# Altium project ice40.PrjPcb
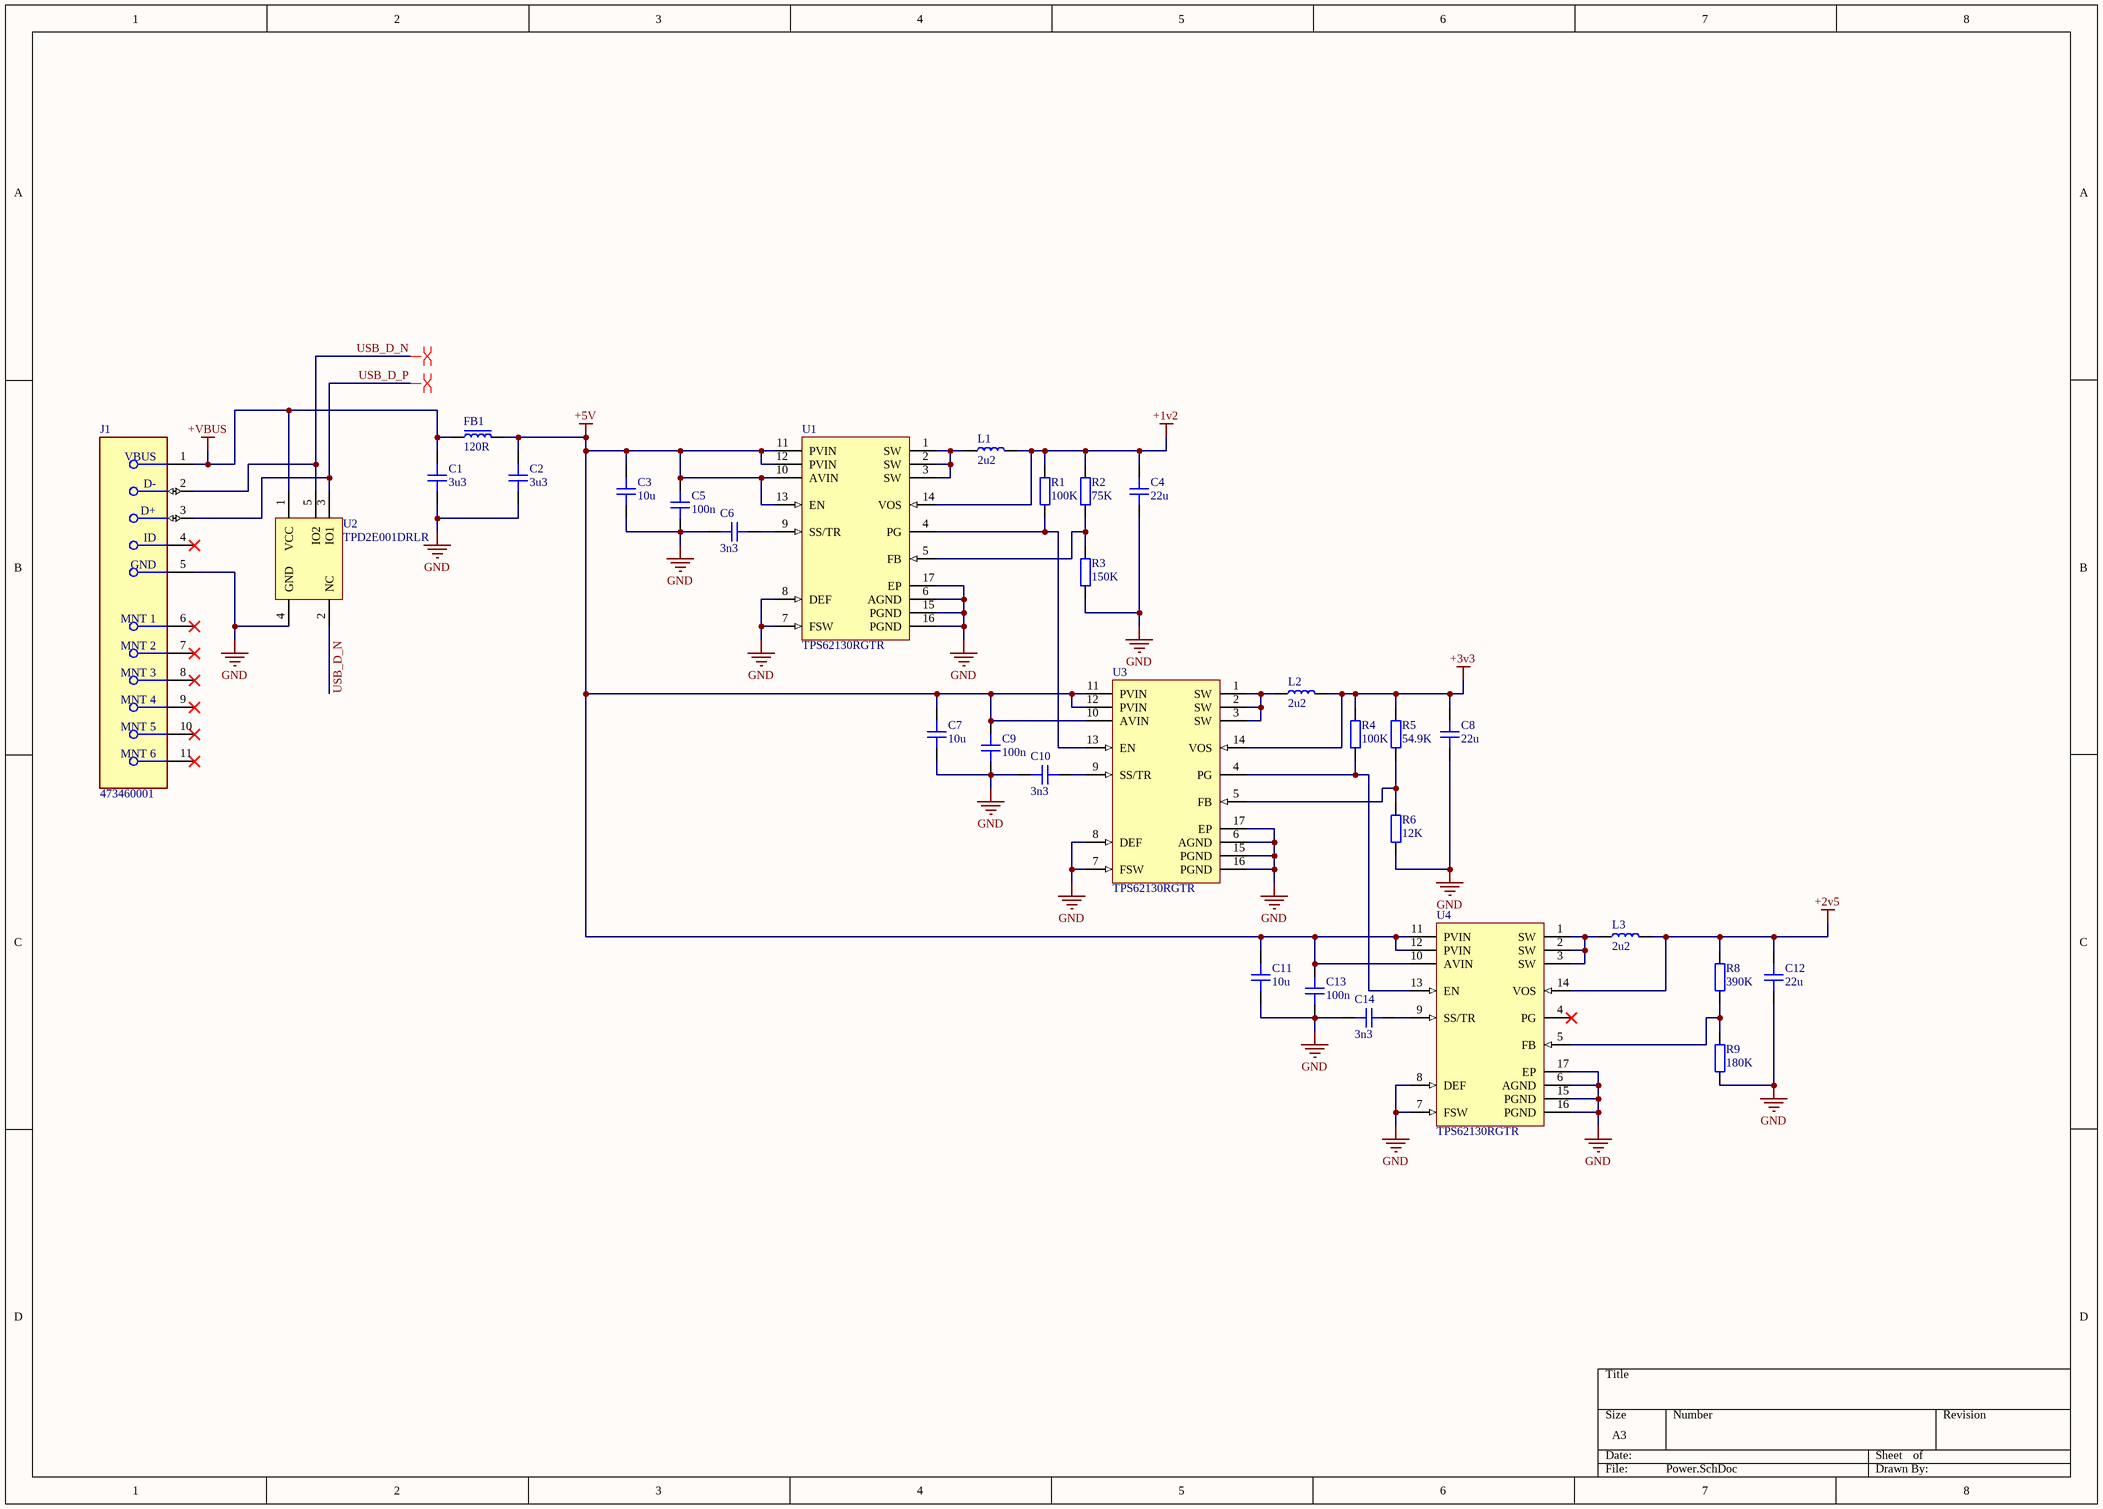
[diagram p0: Power.SchDoc]
3 sheets, 94 parts. Net scope: global (net labels, ports and power ports of the same name join across sheets).
Board file: PCB.PcbDoc
Sheets:
  Power.SchDoc
  IO.SchDoc
  ice40.SchDoc

## Sheet Power.SchDoc
size A3; SheetNumber: 1; SheetTotal: 3

### Parts
C1  3u3  [CAP_0603]
C2  3u3  [CAP_0603]
C3  10u  [CAP_0805]
C4  22u  [CAP_0805]
C5  100n  [CAP_0402]
C6  3n3  [CAP_0402]
C7  10u  [CAP_0805]
C8  22u  [CAP_0805]
C9  100n  [CAP_0402]
C10  3n3  [CAP_0402]
C11  10u  [CAP_0805]
C12  22u  [CAP_0805]
C13  100n  [CAP_0402]
C14  3n3  [CAP_0402]
FB1  120R  [FB_0603]
J1  473460001  [FP-473460001-MFG]
L1  2u2  [IND_1008]
L2  2u2  [IND_1008]
L3  2u2  [IND_1008]
R1  100K  [RES_0402]
R2  75K  [RES_0402]
R3  150K  [RES_0402]
R4  100K  [RES_0402]
R5  54.9K  [RES_0402]
R6  12K  [RES_0402]
R8  390K  [RES_0402]
R9  180K  [RES_0402]
U1  TPS62130RGTR  [RGT0016C_V]
U2  TPD2E001DRLR  [DRL0005A_L]
U3  TPS62130RGTR  [RGT0016C_V]
U4  TPS62130RGTR  [RGT0016C_V]

### Nets
+1v2: C4.2 L1.2 R1.2 R2.2 U1.14(VOS)
+2v5: C12.2 L3.2 R8.2 U4.14(VOS)
+3v3: C8.2 L2.2 R4.2 R5.2 U3.14(VOS)
+5V: C2.2 C3.2 C5.2 C7.2 C9.2 C11.2 C13.2 FB1.2 U1.10(AVIN) U1.11(PVIN) U1.12(PVIN) U1.13(EN) U3.10(AVIN) U3.11(PVIN) U3.12(PVIN) U4.10(AVIN) U4.11(PVIN) U4.12(PVIN)
+VBUS: C1.2 FB1.1 J1.1(VBUS) U2.1(VCC)
GND: C1.1 C2.1 C3.1 C4.1 C5.1 C6.2 C7.1 C8.1 C9.1 C10.2 C11.1 C12.1 C13.1 C14.2 J1.5(GND) R3.1 R6.1 R9.1 U1.6(AGND) U1.7(FSW) U1.8(DEF) U1.15(PGND) U1.16(PGND) U1.17(EP) U2.4(GND) U3.6(AGND) U3.7(FSW) U3.8(DEF) U3.15(PGND) U3.16(PGND) U3.17(EP) U4.6(AGND) U4.7(FSW) U4.8(DEF) U4.15(PGND) U4.16(PGND) U4.17(EP)
USB_D_N: J1.2(D-) U2.2(NC) U2.5(IO2)
USB_D_P: J1.3(D+) U2.3(IO1)
NetC6_1: C6.1 U1.9(SS/TR)
NetC10_1: C10.1 U3.9(SS/TR)
NetC14_1: C14.1 U4.9(SS/TR)
NetL1_1: L1.1 U1.1(SW) U1.2(SW) U1.3(SW)
NetL2_1: L2.1 U3.1(SW) U3.2(SW) U3.3(SW)
NetL3_1: L3.1 U4.1(SW) U4.2(SW) U4.3(SW)
NetR1_1: R1.1 U1.4(PG) U3.13(EN)
NetR2_1: R2.1 R3.2 U1.5(FB)
NetR4_1: R4.1 U3.4(PG) U4.13(EN)
NetR5_1: R5.1 R6.2 U3.5(FB)
NetR8_1: R8.1 R9.2 U4.5(FB)

Not connected (* = marked no-connect by the designer): J1 4(ID)* 6(MNT_1)* 7(MNT_2)* 8(MNT_3)* 9(MNT_4)* 10(MNT_5)* 11(MNT_6)*; U4 4(PG)*

### Layout directives
differential pair: USB_D_N, USB_D_P

### Library data of the parts
C1 C2 = CAP_0603: Capacitor SMD 0603; Manufacturer Part Number: TCC0603X5R335M250CT; Manufacturer: *; Distributor Link: *; LCSC: C5360803; Rating: *; Dielectric: *
C3 C7 C11 = CAP_0805: Capacitor SMD 0805; Manufacturer Part Number: CL21B106KOQNNNE; Manufacturer: *; Distributor Link: *; LCSC: C95841; Rating: *; Dielectric: *
C4 C8 C12 = CAP_0805: Capacitor SMD 0805; Manufacturer Part Number: GRM21BZ71A226ME15L; Manufacturer: *; Distributor Link: *; LCSC: C907991; Rating: *; Dielectric: *
C5 C9 C13 = CAP_0402: Capacitor SMD 0402; Manufacturer Part Number: CL05B104KO5NNNC; Manufacturer: *; Distributor Link: *; LCSC: C1525; Rating: *; Dielectric: *
C6 C10 C14 = CAP_0402: Capacitor SMD 0402; Manufacturer Part Number: CL05B332KB5NNNC; Manufacturer: *; Distributor Link: *; LCSC: C26404; Rating: *; Dielectric: *
FB1 = FB_0603: Ferrite Bead SMD 0603; Manufacturer Part Number: BLM18PG121SN1D; Manufacturer: *; Distributor Link: *; LCSC: C14709
J1 = CMP-2000-05246-2: CONN RCPT USB2.0 MICRO B SMD R/A; Manufacturer: Molex; Conn Orientation: Right Angle; Is Female: yes; Shielding: true; Pitch: 0.65mm; Number Of Contacts: 5; Voltage Rating: 30V; Current Rating: 1.8A; Device Class L2: USB Connectors; Digikey Description: CONN RCPT USB2.0 MICRO B SMD R/A; Height: 2.945mm; RoHS: TRUE; ComponentLink2Description: Datasheet; Octopart: https://octopart.com/47346-0001-molex-7164928; Automotive: No; Package: 0; Category: Conn; Device Class L1: Connectors; Usb Standard: USB 2.0; Temperature: -30°C to +85°C; Temperature Range Low: -30°C; Footprint Url: https://www.molex.com/pdm_docs/sd/473460001_sd.pdf; ComponentLink2URL: https://www.molex.com/webdocs/datasheets/pdf/en-us/0473460001_IO_CONNECTORS.pdf; Lead Free: Yes; Manufacturer Part Number: 473460001; Contact Material: Gold,Nickel; Temperature Range High: +85°C; Device Class L3: unset; LCSC: C132560
L1-L3 = IND_1008: Inductor SMD 1008; Manufacturer Part Number: LQM2HPN2R2MG0L; LCSC: C86092
R1 R4 = RES_0402: Resistor SMD 0402; Manufacturer Part Number: 0402WGF1003TCE; Manufacturer: *; Distributor Link: *; LCSC: C25741
R2 = RES_0402: Resistor SMD 0402; Manufacturer Part Number: 0402WGF7502TCE; Manufacturer: *; Distributor Link: *; LCSC: C25798
R3 = RES_0402: Resistor SMD 0402; Manufacturer Part Number: FRC0402F1503TS; Manufacturer: *; Distributor Link: *; LCSC: C2909320
R5 = RES_0402: Resistor SMD 0402; Manufacturer Part Number: 0402WGF5492TCE; Manufacturer: *; Distributor Link: *; LCSC: C11626
R6 = RES_0402: Resistor SMD 0402; Manufacturer Part Number: 0402WGF1202TCE; Manufacturer: *; Distributor Link: *; LCSC: C25752
R8 = RES_0402: Resistor SMD 0402; Manufacturer Part Number: 0402WGF3903TCE; Manufacturer: *; Distributor Link: *; LCSC: C25782
R9 = RES_0402: Resistor SMD 0402; Manufacturer Part Number: 0402WGF1803TCE; Manufacturer: *; Distributor Link: *; LCSC: C25760
U1 U3 U4 = CMP-0323-00115-3: Buck Step Down Regulator with 3 to 17 V Input and 0.9 to 6 V Output, -40 to 85 degC, 16-Pin QFN (RGT), Green (RoHS & no Sb/Br); Manufacturer: Texas Instruments; Rating: Catalog; Vout(Max)(V): 6; Vin(Min)(V): 3; Switch Current Limit(Typ)(A): 4.2; Iq(Typ)(mA): 0.017; Regulated Outputs(#): 1; Synchronous Rectification: TRUE; SubFamily: Step-Down Regulator; Vin(Max)(V): 17; Duty Cycle(Max)(%): 100; Vout(Min)(V): 0.9; ComponentLink2URL: http://www.ti.com/litv/pdf/mpqf119g; Eco-Plan: Green (RoHS & no Sb/Br); Manufacturer Part Number: TPS62130RGTR; ComponentLink1Description: Datasheet; DatasheetVersion: SLVSAG7; Mounting Technology: Surface Mount; Iout(Max)(A): 3; ComponentLink2Description: Package Specification; Code_JEDEC: MO-220; Topology: Buck; ComponentLink1URL: http://www.ti.com/general/docs/lit/getliterature.tsp?genericPartNumber=TPS62130&fileType=pdf; ComponentLink3URL: Samples URL:http://www.ti.com/product/tps62130#samples; ComponentLink3Description: URL Link1; PackageReference: RGT0016C; PackageVersion: revH, Oct-2011; PackageDescription: 16-Pin Plastic Quad Flat No-Lead, 3 x 3 mm Body, 0.5 mm Pitch, 1.7 x 1.7 mm Exposed Pad; LCSC: C43590
  U3: Parameter 1: *
U2 = CMP-0326-00048-3: Low-Capacitance + / - 15 kV ESD-Protection Array for High-Speed Data Interfaces, 2 Channels, -40 to +85 degC, 5-pin SOT (DRL), Green (RoHS & no Sb/Br); Manufacturer: Texas Instruments; IO Leakage Current(nA): 1; IEC 61000-4-2 Air-Gap(+/- kV): 15; IEC 61000-4-2 Contact(+/- kV): 8; SubFamily: ESD Solution; IO Capacitance(Typ)(pF): 1.5; Breakdown Voltage(Min)(V): 11; USB High Speed: TRUE; ComponentLink3Description: URL Link1; PackageReference: DRL0005A; Manufacturer Part Number: TPD2E001DRLR; PackageDescription: 5-Pin Plastic Small Outline, Flat Lead 0.5 mm Pitch; PackageVersion: revD, Aug-2007; DatasheetVersion: SLLS684F; ComponentLink1Description: Manufacturer URL; ComponentLink2Description: Datasheet; ComponentLink1URL: http://www.ti.com/; ComponentLink2URL: http://www.ti.com/general/docs/lit/getliterature.tsp?genericPartNumber=TPD2E001&fileType=pdf; ComponentLink3URL: SamplesURL:http://www.ti.com/product/tpd2e001#samples; Eco-Plan: Green (RoHS & no Sb/Br); Mounting Technology: Surface Mount; LCSC: C150526

## Sheet IO.SchDoc
size A3; SheetNumber: 2; SheetTotal: 3
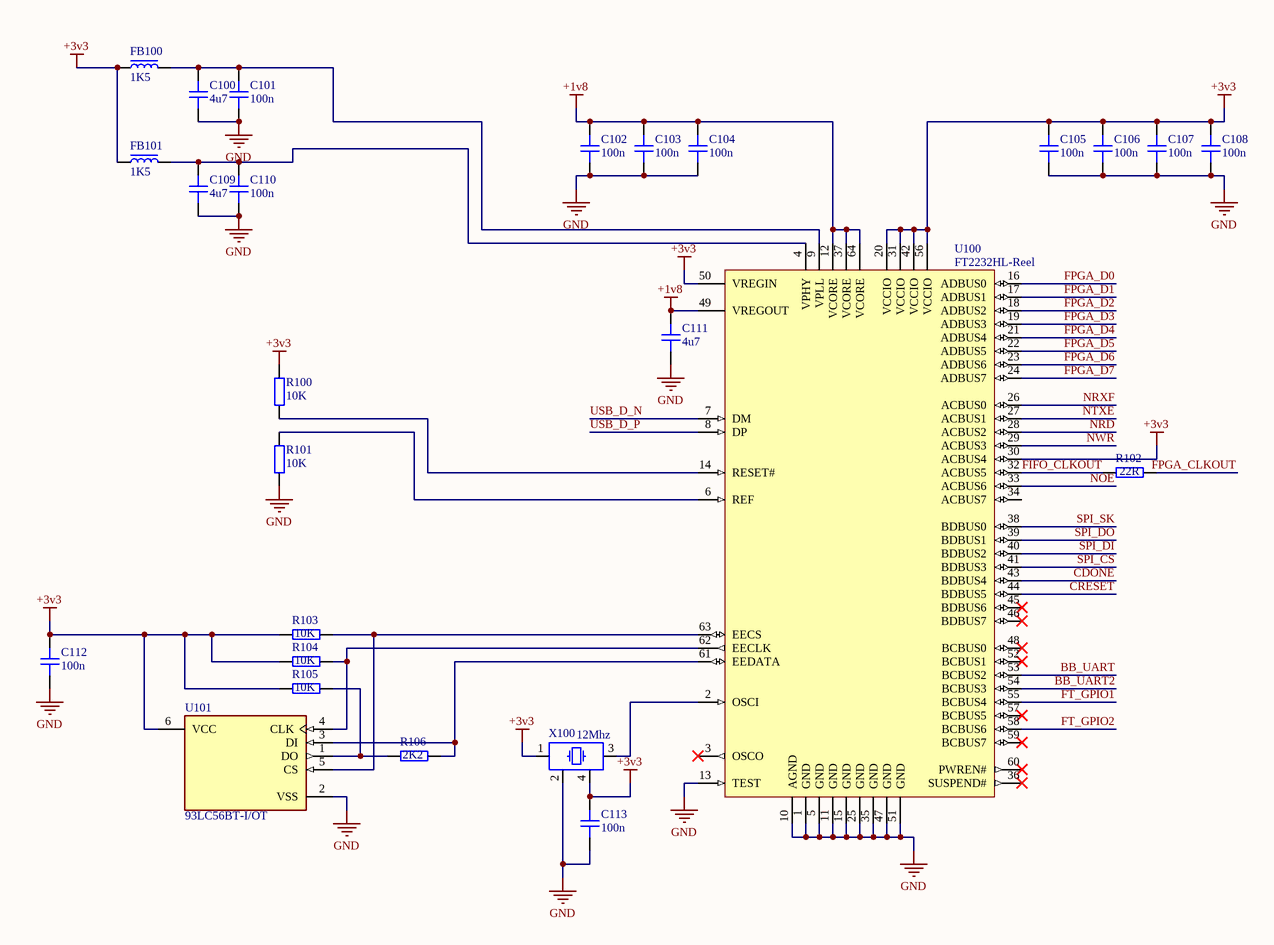
[diagram p1: IO.SchDoc]

### Parts
C100  4u7  [CAP_0402]
C101  100n  [CAP_0402]
C102  100n  [CAP_0402]
C103  100n  [CAP_0402]
C104  100n  [CAP_0402]
C105  100n  [CAP_0402]
C106  100n  [CAP_0402]
C107  100n  [CAP_0402]
C108  100n  [CAP_0402]
C109  4u7  [CAP_0402]
C110  100n  [CAP_0402]
C111  4u7  [CAP_0402]
C112  100n  [CAP_0402]
C113  100n  [CAP_0402]
FB100  1K5  [FB_0603]
FB101  1K5  [FB_0603]
R100  10K  [RES_0402]
R101  10K  [RES_0402]
R102  22R  [RES_0402]
R103  10K  [RES_0402]
R104  10K  [RES_0402]
R105  10K  [RES_0402]
R106  2K2  [RES_0402]
U100  FT2232HL-Reel  [LQFP-64_M]
U101  93LC56BT-I/OT  [FP-C04-028-MFG]
X100  12Mhz  [XTAL_2520]

### Nets
+1v8: C102.2 C103.2 C104.2 C111.2 U100.12(VCORE) U100.37(VCORE) U100.49(VREGOUT) U100.64(VCORE)
+3v3: C105.2 C106.2 C107.2 C108.2 C112.2 C113.2 FB100.1 FB101.1 R100.2 R103.1 R104.1 R105.1 U100.20(VCCIO) U100.30(ACBUS4) U100.31(VCCIO) U100.42(VCCIO) U100.50(VREGIN) U100.56(VCCIO) U101.6(VCC) X100.1 X100.4
GND: C100.1 C101.1 C102.1 C103.1 C104.1 C105.1 C106.1 C107.1 C108.1 C109.1 C110.1 C111.1 C112.1 C113.1 R101.2 U100.1(GND) U100.5(GND) U100.10(AGND) U100.11(GND) U100.13(TEST) U100.15(GND) U100.25(GND) U100.35(GND) U100.47(GND) U100.51(GND) U101.2(VSS) X100.2
BB_UART: U100.53(BCBUS2)
BB_UART2: U100.54(BCBUS3)
CDONE: U100.43(BDBUS4)
CRESET: U100.44(BDBUS5)
FIFO_CLKOUT: R102.1 U100.32(ACBUS5)
FPGA_CLKOUT: R102.2
FPGA_D0: U100.16(ADBUS0)
FPGA_D1: U100.17(ADBUS1)
FPGA_D2: U100.18(ADBUS2)
FPGA_D3: U100.19(ADBUS3)
FPGA_D4: U100.21(ADBUS4)
FPGA_D5: U100.22(ADBUS5)
FPGA_D6: U100.23(ADBUS6)
FPGA_D7: U100.24(ADBUS7)
FT_GPIO1: U100.55(BCBUS4)
FT_GPIO2: U100.58(BCBUS6)
NOE: U100.33(ACBUS6)
NRD: U100.28(ACBUS2)
NRXF: U100.26(ACBUS0)
NTXE: U100.27(ACBUS1)
NWR: U100.29(ACBUS3)
SPI_CS: U100.41(BDBUS3)
SPI_DI: U100.40(BDBUS2)
SPI_DO: U100.39(BDBUS1)
SPI_SK: U100.38(BDBUS0)
USB_D_N: U100.7(DM)
USB_D_P: U100.8(DP)
NetC100_2: C100.2 C101.2 FB100.2 U100.9(VPLL)
NetC109_2: C109.2 C110.2 FB101.2 U100.4(VPHY)
NetR100_1: R100.1 U100.14(RESET#)
NetR101_1: R101.1 U100.6(REF)
NetR103_2: R103.2 U100.63(EECS) U101.5(CS)
NetR104_2: R104.2 U100.62(EECLK) U101.4(CLK)
NetR105_2: R105.2 R106.1 U101.1(DO)
NetR106_2: R106.2 U100.61(EEDATA) U101.3(DI)
NetU100_2: U100.2(OSCI) X100.3

Not connected (* = marked no-connect by the designer): U100 3(OSCO)* 34(ACBUS7) 36(SUSPEND#)* 45(BDBUS6)* 46(BDBUS7)* 48(BCBUS0)* 52(BCBUS1)* 57(BCBUS5)* 59(BCBUS7)* 60(PWREN#)*

### Library data of the parts
C100 C109 C111 = CAP_0402: Capacitor SMD 0402; Manufacturer Part Number: GRM155R61E475ME15D; Manufacturer: *; Distributor Link: *; LCSC: C2858031; Rating: *; Dielectric: *
C101-C108 C110 C112 C113 = CAP_0402: as C5 on sheet Power; Manufacturer: *; Distributor Link: *; LCSC: C1525; Rating: *; Dielectric: *
FB100 FB101 = FB_0603: Ferrite Bead SMD 0603; Manufacturer Part Number: BLM18HE152SN1D; Manufacturer: *; Distributor Link: *; LCSC: C82155
R100 R101 R103-R105 = RES_0402: Resistor SMD 0402; Manufacturer Part Number: 0402WGF1002TCE; Manufacturer: *; Distributor Link: *; LCSC: C25744
R102 = RES_0402: Resistor SMD 0402; Manufacturer Part Number: 0402WGF220JTCE; Manufacturer: *; Distributor Link: *; LCSC: C25092
R106 = RES_0402: Resistor SMD 0402; Manufacturer Part Number: 0402WGF2201TCE; Manufacturer: *; Distributor Link: *; LCSC: C25879
U100 = CMP-0078-00023-3: Dual High Speed USB To Multipurpose UART/FIFO IC, 64-pin LQFP, Tape and Reel; Manufacturer: FTDI; DatasheetVersion: ver 2.21, Jun-2012; ComponentLink1URL: http://www.ftdichip.com/; Manufacturer Part Number: FT2232HL-Reel; ComponentLink2Description: Datasheet; RevisionNote: DatasheetVersion updated to 2.21 Jun-2012; PackageVersion: Jun-12; ComponentLink1Description: Manufacturer URL; ComponentLink2URL: http://www.ftdichip.com/Support/Documents/DataSheets/ICs/DS_FT2232H.pdf; PackageReference: LQFP-64; PackageDescription: 64-Pin Thin Quad Flat Pack, 10 x 10 x 1.4 mm Body, 0.5 mm Pitch; LCSC: C27882
U101 = CMP-0162-00356-2: IC EEPROM 2K SPI 2MHZ SOT23-6; Access Time: 250ns; Density: 2Kb; Max Supply Voltage: 5.5V; Interface: Serial; Min Supply Voltage: 2.5V; Nominal Supply Current: 2mA; Number of Pins: 6; Radiation Hardening: No; Length: 3.1mm; Height: 1.3mm; Min Operating Temperature: -40°C; Max Operating Temperature: 85°C; Lead Free: Lead Free; Memory Type: EEPROM; Contact Plating: Tin; REACH SVHC: No SVHC; Package Quantity: 3000; Frequency: 2MHz; Width: 1.8mm; Max Frequency: 2MHz; Case/Package: SOT-23; Mount: Surface Mount; Packaging: Tape and Reel; Memory Size: 2Kb; LCSC: C190271; Manufacturer Part Number: 93LC56BT-I/OT
X100 = XTAL_2520: Crystal SMD 2520; Manufacturer Part Number: SX2M12.000B10F20TNN; Manufacturer: *; Distributor Link: *; LCSC: C7431262

## Sheet ice40.SchDoc
size A3; SheetNumber: 3; SheetTotal: 3
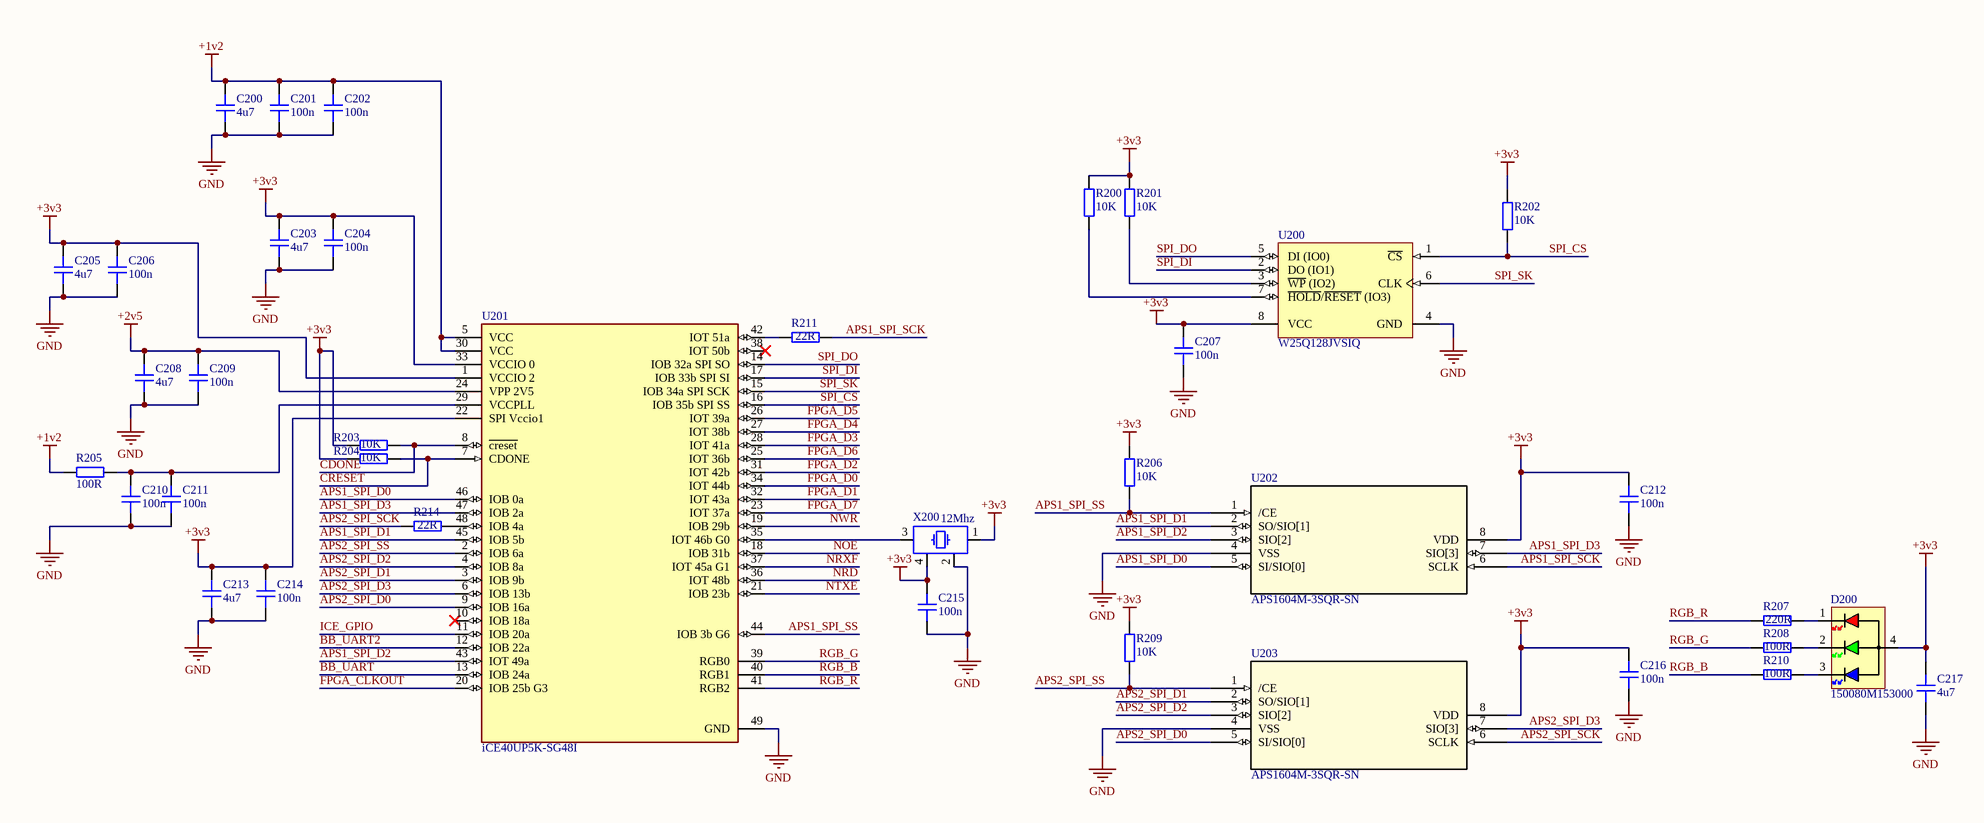
[diagram p2: ice40.SchDoc]

### Parts
C200  4u7  [CAP_0402]
C201  100n  [CAP_0402]
C202  100n  [CAP_0402]
C203  4u7  [CAP_0402]
C204  100n  [CAP_0402]
C205  4u7  [CAP_0402]
C206  100n  [CAP_0402]
C207  100n  [CAP_0402]
C208  4u7  [CAP_0402]
C209  100n  [CAP_0402]
C210  100n  [CAP_0402]
C211  100n  [CAP_0402]
C212  100n  [CAP_0402]
C213  4u7  [CAP_0402]
C214  100n  [CAP_0402]
C215  100n  [CAP_0402]
C216  100n  [CAP_0402]
C217  4u7  [CAP_0402]
D200  150080M153000  [150080M153000]
R200  10K  [RES_0402]
R201  10K  [RES_0402]
R202  10K  [RES_0402]
R203  10K  [RES_0402]
R204  10K  [RES_0402]
R205  100R  [RES_0402]
R206  10K  [RES_0402]
R207  220R  [RES_0402]
R208  100R  [RES_0402]
R209  10K  [RES_0402]
R210  100R  [RES_0402]
R211  22R  [RES_0402]
R214  22R  [RES_0402]
U200  W25Q128JVSIQ  [WINB-SOIC-8_M]
U201  iCE40UP5K-SG48I  [FP-QFN-48-IPC_C]
U202  APS1604M-3SQR-SN  [SOP8L_APS1604M-3SQR-SN_APY]
U203  APS1604M-3SQR-SN  [SOP8L_APS1604M-3SQR-SN_APY]
X200  12Mhz  [XTAL_2520]

### Nets
+1v2: C200.2 C201.2 C202.2 R205.1 U201.5(VCC) U201.30(VCC)
+2v5: C208.2 C209.2 U201.24(VPP_2V5)
+3v3: C203.2 C204.2 C205.2 C206.2 C207.2 C212.2 C213.2 C214.2 C215.1 C216.2 C217.2 D200.4(AC) R200.2 R201.2 R202.2 R203.1 R204.1 R206.2 R209.2 U200.8(VCC) U201.1(VCCIO_2) U201.22(SPI_Vccio1) U201.33(VCCIO_0) U202.8(VDD) U203.8(VDD) X200.1 X200.4
GND: C200.1 C201.1 C202.1 C203.1 C204.1 C205.1 C206.1 C207.1 C208.1 C209.1 C210.1 C211.1 C212.1 C213.1 C214.1 C215.2 C216.1 C217.1 U200.4(GND) U201.49(GND) U202.4(VSS) U203.4(VSS) X200.2
APS1_SPI_D0: U201.46(IOB_0a) U202.5(SI/SIO[0])
APS1_SPI_D1: U201.45(IOB_5b) U202.2(SO/SIO[1])
APS1_SPI_D2: U201.43(IOT_49a) U202.3(SIO[2])
APS1_SPI_D3: U201.47(IOB_2a) U202.7(SIO[3])
APS1_SPI_SCK: R211.2 U202.6(SCLK)
APS1_SPI_SS: R206.1 U201.44(IOB_3b_G6) U202.1(/CE)
APS2_SPI_D0: U201.9(IOB_16a) U203.5(SI/SIO[0])
APS2_SPI_D1: U201.3(IOB_9b) U203.2(SO/SIO[1])
APS2_SPI_D2: U201.4(IOB_8a) U203.3(SIO[2])
APS2_SPI_D3: U201.6(IOB_13b) U203.7(SIO[3])
APS2_SPI_SCK: R214.1 U203.6(SCLK)
APS2_SPI_SS: R209.1 U201.2(IOB_6a) U203.1(/CE)
BB_UART: U201.13(IOB_24a)
BB_UART2: U201.12(IOB_22a)
CDONE: R203.2 U201.8(~{creset})
CRESET: R204.2 U201.7(CDONE)
FPGA_CLKOUT: U201.20(IOB_25b_G3)
FPGA_D0: U201.34(IOT_44b)
FPGA_D1: U201.32(IOT_43a)
FPGA_D2: U201.31(IOT_42b)
FPGA_D3: U201.28(IOT_41a)
FPGA_D4: U201.27(IOT_38b)
FPGA_D5: U201.26(IOT_39a)
FPGA_D6: U201.25(IOT_36b)
FPGA_D7: U201.23(IOT_37a)
ICE_GPIO: U201.11(IOB_20a)
NOE: U201.18(IOB_31b)
NRD: U201.36(IOT_48b)
NRXF: U201.37(IOT_45a_G1)
NTXE: U201.21(IOB_23b)
NWR: U201.19(IOB_29b)
RGB_B: R210.1 U201.40(RGB1)
RGB_G: R208.1 U201.39(RGB0)
RGB_R: R207.1 U201.41(RGB2)
SPI_CS: R202.1 U200.1(~{CS}) U201.16(IOB_35b_SPI_SS)
SPI_DI: U200.2(DO_(IO1)) U201.17(IOB_33b_SPI_SI)
SPI_DO: U200.5(DI_(IO0)) U201.14(IOB_32a_SPI_SO)
SPI_SK: U200.6(CLK) U201.15(IOB_34a_SPI_SCK)
NetC210_2: C210.2 C211.2 R205.2 U201.29(VCCPLL)
NetD200_1: D200.1(CR) R207.2
NetD200_2: D200.2(CG) R208.2
NetD200_3: D200.3(CB) R210.2
NetR200_1: R200.1 U200.7(~{HOLD}/~{RESET}_(IO3))
NetR201_1: R201.1 U200.3(~{WP}_(IO2))
NetR211_1: R211.1 U201.42(IOT_51a)
NetR214_2: R214.2 U201.48(IOB_4a)
NetU201_35: U201.35(IOT_46b_G0) X200.3

Not connected (* = marked no-connect by the designer): U201 10(IOB_18a)* 38(IOT_50b)*

### Library data of the parts
C200 C203 C205 C208 C213 C217 = CAP_0402: as C100 on sheet IO; Manufacturer: *; Distributor Link: *; LCSC: C2858031; Rating: *; Dielectric: *
C201 C202 C204 C206 C207 C209-C212 C214-C216 = CAP_0402: as C5 on sheet Power; Manufacturer: *; Distributor Link: *; LCSC: C1525; Rating: *; Dielectric: *
D200 = 150080M153000: RGB LED Common Anode SMD Diffused 0805 Top View; Manufacturer: Wurth; Manufacturer Part Number: 150080M153000; Distributor Link: https://www.mouser.de/ProductDetail/Wurth-Elektronik/150080M153000?qs=5aG0NVq1C4wI5cZ2wabu5A%3D%3D; LCSC: C6785001
R200-R204 R206 R209 = RES_0402: as R100 on sheet IO; Manufacturer: *; Distributor Link: *; LCSC: C25744
R205 R208 R210 = RES_0402: Resistor SMD 0402; Manufacturer Part Number: 0402WGF1000TCE; Manufacturer: *; Distributor Link: *; LCSC: C25076
R207 = RES_0402: Resistor SMD 0402; Manufacturer Part Number: 0402WGF2200TCE; Manufacturer: *; Distributor Link: *; LCSC: C25091
R211 R214 = RES_0402: as R102 on sheet IO; Manufacturer: *; Distributor Link: *; LCSC: C25092
U200 = CMP-2000-05005-1: 3V 128M-Bit Serial Flash Memory with Dual/Quad SPI & QPI, 2.7 to 3.6 V, -40 to 85 degC, 8-Pin SOIC, RoHS, Tape and Reel; Manufacturer: Winbond; Number of Words: 16777216; Address Bus: 24b; Word Size: 8b; Boot Type: NotRequired; Supply Current: 20mA; Operating Supply Voltage (Max): 3.6V; Sync/Async: Synchronous; Rad Hardened: No; Interface Type: Serial(SPI); Access Time (Max): 7ns; Operating Supply Voltage (Min): 2.7V; Operating Supply Voltage (Typ): 3/3.3V; Programmable: Yes; Density: 134217728Bit; Cell Type: NOR; Package Description: 8-Pin Small Outline Integrated Circuit, Body 5.28 x 5.28 mm, Pitch 1.27 mm; Datasheet URL: http://download.siliconexpert.com/pdfs/2015/11/30/6/42/17/890/win_/manual/3w25q128fv20rev.l2008242015.pdf; Package Reference: SS-8; Package Type: SOICW; Datasheet Version: Rev. L, 08/2015; Manufacturer URL: http://www.winbond.com/hq/index.html?__locale=en; Pin Count: 8; Operating Temperature Classification: Industrial; Operating Temperature (Min): -40C; Program/Erase Volt (Typ): 2.7to3.6V; Operating Temperature (Max): 85C; Mounting: SurfaceMount; Operating Temp Range: -40Cto85C; LCSC: C113767; Manufacturer Part Number: W25Q128JVSIQ
U201 = CMP-17932-000001-1: ICE40-ULTRAPLUS, 5280 LUTS, 1.2V; Manufacturer: Lattice; Propagation Delay: 9ns; Frequency: 48MHz; Max Junction Temp: +100°C; Ram Size: 1024Kbits; Number Of Logic Elements Cells: 5280; Number Of I/Os: 39; Max Supply Voltage: 3.46V; Standoff Height: 0mm; Nominal Supply Current: 2.5-12mA; Min Supply Voltage: 1.14V; Number Of Logic Blocks: 660; Device Class L3: FPGAs - Field Programmable Gate Arrays; Temperature Range High: +100°C; Device Class L1: Integrated Circuits (ICs); Device Class L2: Embedded Processors and Controllers; Ipc Land Pattern Name: QFN50P700X700X90-48; Automotive: No; RoHS: TRUE; Lead Free: Yes; Height: 1mm; ComponentLink2Description: Datasheet; Manufacturer Part Number: iCE40UP5K-SG48I; Temperature Range Low: -40°C; Package: QFN-48; Temperature: -40°C to +100°C; Octopart: https://octopart.com/ice40up5k-sg48i-lattice+semiconductor-87369311; Footprint Url: http://www.latticesemi.com/view_document?document_id=213; Digikey Description: ICE40-ULTRAPLUS, 5280 LUTS, 1.2V; ComponentLink2URL: http://www.latticesemi.com/view_document?document_id=51968; Category: IC; LCSC: C2678152
U202 U203 = APS1604M-3SQR-SN: No Description Available; Mfr_Name: AP Memory; RefDes: RefDes; Type: Type; LCSC: C18214056; Manufacturer Part Number: APS1604M-3SQR-SN
X200 = XTAL_2520: as X100 on sheet IO; Manufacturer: *; Distributor Link: *; LCSC: C7431262

## Nets that join several sheets
+1v2: Power (5 pins), ice40 (6 pins)
+2v5: Power (C12.2 L3.2 R8.2 U4.14), ice40 (C208.2 C209.2 U201.24)
+3v3: Power (5 pins), IO (21 pins), ice40 (27 pins)
GND: Power (37 pins), IO (27 pins), ice40 (23 pins)
BB_UART: IO (U100.53), ice40 (U201.13)
BB_UART2: IO (U100.54), ice40 (U201.12)
CDONE: IO (U100.43), ice40 (R203.2 U201.8)
CRESET: IO (U100.44), ice40 (R204.2 U201.7)
FPGA_CLKOUT: IO (R102.2), ice40 (U201.20)
FPGA_D0: IO (U100.16), ice40 (U201.34)
FPGA_D1: IO (U100.17), ice40 (U201.32)
FPGA_D2: IO (U100.18), ice40 (U201.31)
FPGA_D3: IO (U100.19), ice40 (U201.28)
FPGA_D4: IO (U100.21), ice40 (U201.27)
FPGA_D5: IO (U100.22), ice40 (U201.26)
FPGA_D6: IO (U100.23), ice40 (U201.25)
FPGA_D7: IO (U100.24), ice40 (U201.23)
NOE: IO (U100.33), ice40 (U201.18)
NRD: IO (U100.28), ice40 (U201.36)
NRXF: IO (U100.26), ice40 (U201.37)
NTXE: IO (U100.27), ice40 (U201.21)
NWR: IO (U100.29), ice40 (U201.19)
SPI_CS: IO (U100.41), ice40 (R202.1 U200.1 U201.16)
SPI_DI: IO (U100.40), ice40 (U200.2 U201.17)
SPI_DO: IO (U100.39), ice40 (U200.5 U201.14)
SPI_SK: IO (U100.38), ice40 (U200.6 U201.15)
USB_D_N: Power (J1.2 U2.2 U2.5), IO (U100.7)
USB_D_P: Power (J1.3 U2.3), IO (U100.8)